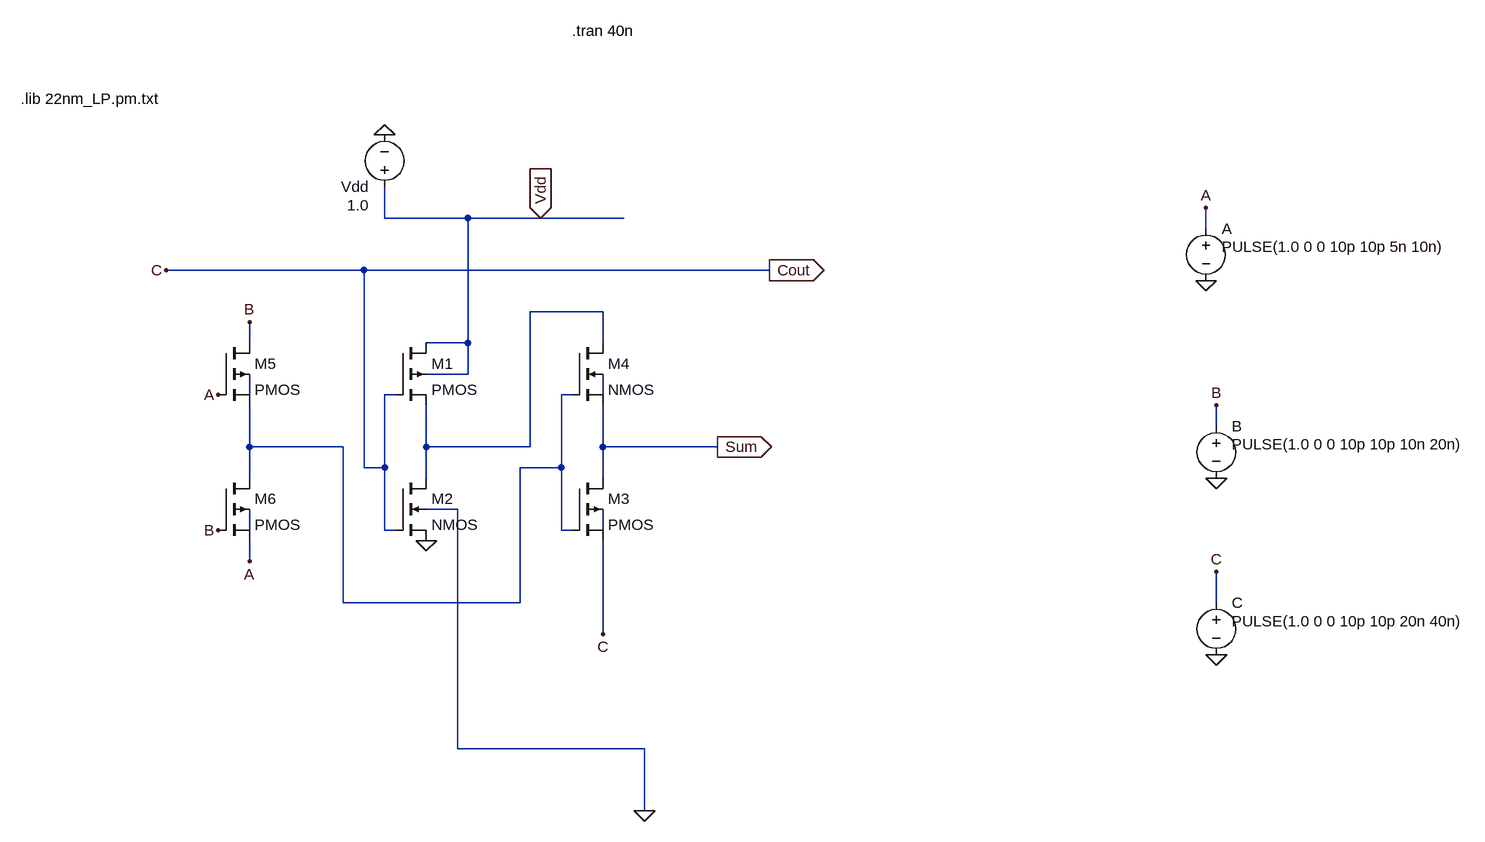
[diagram p0: schematic InXA1_45nm.asc]
InXA1_45nm.asc, the LTspice schematic file:
Version 4
SHEET 1 1044 692
WIRE -640 -240 -640 -288
WIRE -512 -240 -640 -240
WIRE -400 -240 -512 -240
WIRE -272 -240 -400 -240
WIRE 624 -224 624 -256
WIRE -672 -160 -976 -160
WIRE -48 -160 -672 -160
WIRE -304 -96 -416 -96
WIRE -848 -48 -848 -80
WIRE -512 -48 -512 -240
WIRE -512 -48 -576 -48
WIRE -304 -48 -304 -96
WIRE -512 0 -512 -48
WIRE -512 0 -576 0
WIRE -848 32 -848 0
WIRE -624 32 -640 32
WIRE -352 32 -368 32
WIRE -304 32 -304 0
WIRE 640 80 640 48
WIRE -848 112 -848 48
WIRE -704 112 -848 112
WIRE -576 112 -576 48
WIRE -416 112 -416 -96
WIRE -416 112 -576 112
WIRE -304 112 -304 48
WIRE -128 112 -304 112
WIRE -672 144 -672 -160
WIRE -640 144 -640 32
WIRE -640 144 -672 144
WIRE -368 144 -368 32
WIRE -368 144 -432 144
WIRE -848 160 -848 112
WIRE -576 160 -576 112
WIRE -304 160 -304 112
WIRE -528 208 -576 208
WIRE -848 240 -848 208
WIRE -640 240 -640 144
WIRE -624 240 -640 240
WIRE -368 240 -368 144
WIRE -352 240 -368 240
WIRE -304 240 -304 208
WIRE -848 288 -848 256
WIRE -704 352 -704 112
WIRE -432 352 -432 144
WIRE -432 352 -704 352
WIRE 640 352 640 304
WIRE -304 400 -304 256
WIRE -528 576 -528 208
WIRE -240 576 -528 576
WIRE -240 672 -240 576
FLAG -240 672 0
FLAG 624 -144 0
FLAG 640 160 0
FLAG 640 432 0
FLAG 624 -256 A
FLAG 640 48 B
FLAG 640 304 C
FLAG -400 -240 Vdd
IOPIN -400 -240 In
FLAG -640 -368 0
FLAG -304 400 C
FLAG -896 32 A
FLAG -896 240 B
FLAG -48 -160 Cout
IOPIN -48 -160 Out
FLAG -976 -160 C
FLAG -128 112 Sum
IOPIN -128 112 Out
FLAG -576 256 0
FLAG -848 288 A
FLAG -848 -80 B
SYMBOL voltage 624 -240 R0
WINDOW 3 24 44 Left 2
WINDOW 123 0 0 Left 0
WINDOW 39 0 0 Left 0
SYMATTR Value PULSE(1.0 0 0 10p 10p 5n 10n)
SYMATTR InstName A
SYMBOL voltage 640 64 R0
WINDOW 3 24 44 Left 2
WINDOW 123 0 0 Left 0
WINDOW 39 0 0 Left 0
SYMATTR Value PULSE(1.0 0 0 10p 10p 10n 20n)
SYMATTR InstName B
SYMBOL voltage 640 336 R0
WINDOW 3 24 44 Left 2
WINDOW 123 0 0 Left 0
WINDOW 39 0 0 Left 0
SYMATTR Value PULSE(1.0 0 0 10p 10p 20n 40n)
SYMATTR InstName C
SYMBOL voltage -640 -272 R180
WINDOW 3 24 -12 Left 2
WINDOW 123 0 0 Left 0
WINDOW 39 0 0 Left 0
SYMATTR Value 1.0
SYMATTR InstName Vdd
SYMBOL pmos4 -624 -48 R0
SYMATTR InstName M1
SYMATTR Value2 l=45n w=2u
SYMBOL nmos4 -624 160 R0
SYMATTR InstName M2
SYMATTR Value2 l=45n w=1u
SYMBOL nmos4 -352 -48 R0
SYMATTR InstName M4
SYMATTR Value2 l=45n w=1u
SYMBOL pmos4 -352 160 R0
SYMATTR InstName M3
SYMATTR Value2 l=45n w=2u
SYMBOL pmos4 -896 -48 R0
SYMATTR InstName M5
SYMATTR Value2 l=45n w=2u
SYMBOL pmos4 -896 160 R0
SYMATTR InstName M6
SYMATTR Value2 l=45n w=2u
TEXT -1200 -424 Left 2 !.lib 22nm_LP.pm.txt
TEXT -352 -528 Left 2 !.tran 40n

The netlist it stands for:
* InXA1_45nm.asc
V§A A 0 PULSE(1.0 0 0 10p 10p 5n 10n)
V§B B 0 PULSE(1.0 0 0 10p 10p 10n 20n)
V§C Cout 0 PULSE(1.0 0 0 10p 10p 20n 40n)
Vdd Vdd 0 1.0
M1 Vdd Cout N001 Vdd PMOS l=45n w=2u
M2 N001 Cout 0 0 NMOS l=45n w=1u
M4 N001 N003 Sum N004 NMOS l=45n w=1u
M3 Sum N003 Cout N006 PMOS l=45n w=2u
M5 B A N003 N002 PMOS l=45n w=2u
M6 N003 B A N005 PMOS l=45n w=2u
.model NMOS NMOS
.model PMOS PMOS
.lib standard.mos
.lib 22nm_LP.pm.txt
.tran 40n
.backanno
.end

* Results of the author's LTspice run, read from the files saved beside the schematic
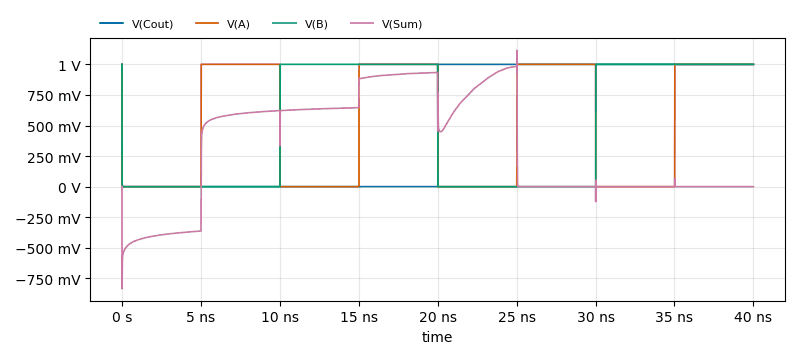
[diagram p1: Transient Analysis of InXA1_45nm.asc, plotted from the saved traces]
* Transient Analysis, 1 run:
*   V(Cout): min 0 V, max 1 V, average 499.7 mV, rms 706.9 mV, last 1 V
*   V(A): min 0 V, max 1 V, average 499 mV, rms 706.2 mV, last 1 V
*   V(B): min 0 V, max 1 V, average 499.5 mV, rms 706.6 mV, last 1 V
*   V(Sum): min -835 mV, max 1.114 V, average 314 mV, rms 547.5 mV, last 8.98 µV